# Altium project EDNPV.PrjPcb
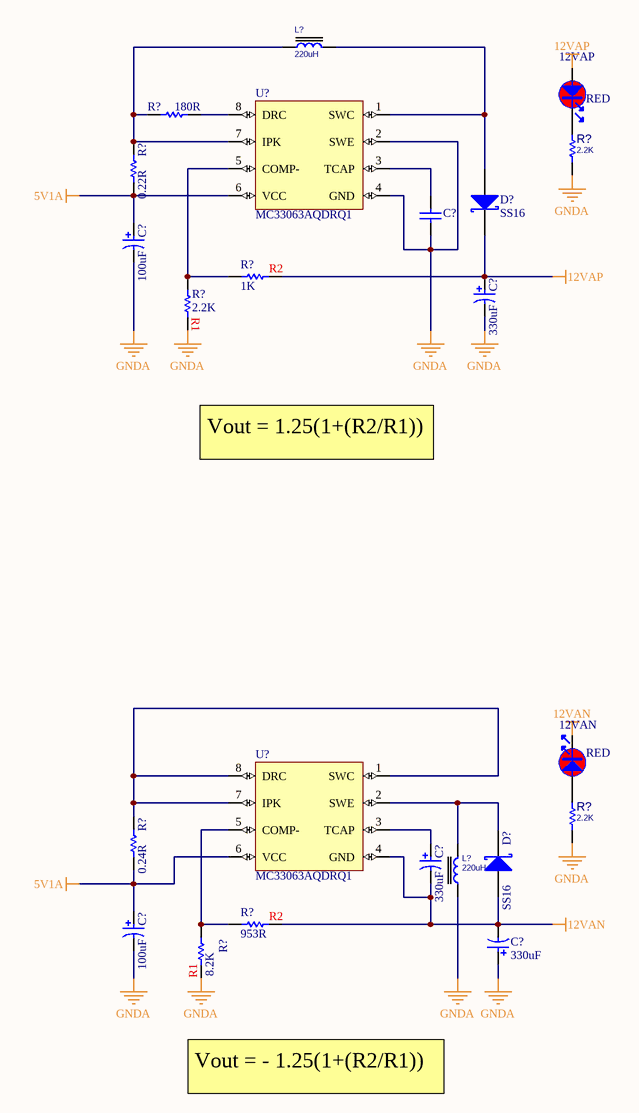
[diagram p0: EDNPV.SchDoc]
1 sheet, 23 parts. Net scope: global (net labels, ports and power ports of the same name join across sheets).
Board file: EDNPV.PcbDoc

## Sheet EDNPV.SchDoc
size A0

### Parts
(Parts that share a designator on the sheet are numbered #1, #2 ... from top to bottom, then left to right.)
?#1  12VAP  value RED  [LED_0603_OSRAM_LS-Q976-NR-1_RED_1A2K_H0P8]
?#2  12VAN  value RED  [LED_0603_OSRAM_LS-Q976-NR-1_RED_1A2K_H0P8]
C?#1  Capacitance: 100uF  [KEMT-T491-A_L]  (hidden comment: T491A476M006AT)
C?#2  CAP0603  [C0603]  (value not drawn)
C?#3  Capacitance: 330uF  [KEMT-T491-A_L]  (hidden comment: T491A476M006AT)
C?#4  Capacitance: 330uF  [KEMT-T491-A_L]  (hidden comment: T491A476M006AT)
C?#5  Capacitance: 100uF  [KEMT-T491-A_L]  (hidden comment: T491A476M006AT)
C?#6  Capacitance: 330uF  [KEMT-T491-A_L]  (hidden comment: T491A476M006AT)
D?#1  SS16  [FAIR-SMA-2_B_V]
D?#2  SS16  [FAIR-SMA-2_B_V]
L?#1  220uH  [L_7]
L?#2  220uH  [L_7]
R?#1  value 180R  [R1206]
R?#2  2.2K  [R0603]
R?#3  value 0.22R  [R1206]
R?#4  1K  [R0603]
R?#5  2.2K  [R0603]
R?#6  2.2K  [R0603]
R?#7  value 0.24R  [R1206]
R?#8  953R  [R0603]
R?#9  8.2K  [R0603]
U?#1  MC33063AQDRQ1  [D0008A_L]
U?#2  MC33063AQDRQ1  [D0008A_L]

### Nets
5V1A: C?#1.1 C?#5.1 R?#3.1 R?#7.1 U?#1.6(VCC) U?#2.6(VCC)
12VAN: ?#2.2 C?#4.2 C?#6.2 D?#2.1(A) R?#8.1 U?#2.4(GND)
12VAP: ?#1.1 C?#3.1 D?#1.2(K) R?#4.1
GNDA: C?#1.2 C?#2.1 C?#3.2 C?#5.2 C?#6.1 L?#2.1 R?#2.1 R?#5.1 R?#6.1 R?#9.1 U?#1.2(SWE) U?#1.4(GND)
Net?#1_2: ?#1.2 R?#2.2
Net?#2_1: ?#2.1 R?#6.2
NetC?#2_2: C?#2.2 U?#1.3(TCAP)
NetC?#4_1: C?#4.1 U?#2.3(TCAP)
NetD?#1_1: D?#1.1(A) L?#1.2 U?#1.1(SWC)
NetD?#2_2: D?#2.2(K) L?#2.2 U?#2.2(SWE)
NetL?#1_1: L?#1.1 R?#1.1 R?#3.2 U?#1.7(IPK)
NetR?#1_2: R?#1.2 U?#1.8(DRC)
NetR?#4_2: R?#4.2 R?#5.2 U?#1.5(COMP-)
NetR?#7_2: R?#7.2 U?#2.1(SWC) U?#2.7(IPK) U?#2.8(DRC)
NetR?#8_2: R?#8.2 R?#9.2 U?#2.5(COMP-)

### Notes on the sheet
- (near R?#4) R2
- (near R?#5) R1
- Vout = 1.25(1+(R2/R1))
- (near R?#8) R2
- (near R?#9) R1
- Vout = - 1.25(1+(R2/R1))

### Library data of the parts
?#1 ?#2 = MCD-00586: LED Red, 0603 SMD, Forward Voltage Typ=2V, Max=2.5V; Part_Type: Display; Manufacturer_Part_Number: LS Q976-NR-1; Manufacturer: OSRAM OPTO SEMICONDUCTORS; Alternate_Manufacturer_Part_Number: VLMS1300-GS08; Alternate_Manufacturer: VISHAY SEMICONDUCTOR OPTO DIVISION; Provided_By: SUBCO; Internal_Part_Number: MCD-00586; Status: Released; Package: LED 0603; ComponentLink1Description: Datasheet; ComponentLink1URL: http://tunmcdsvn.tun.st.com/Component_Datasheet_Library/Trunk/Display/OSRAM_LED_RED_LS Q976-NR-1; Order_Code_Digikey: 475-2512-1-ND; ECCN_US: n/a; ECCN_EU: n/a
C?#1 C?#3-C?#6 = CMP-2000-07189-1: Tantalum Surface Mount Capacitor, 47 uF, +/- 20%, 6.3 V, -55 to 125 degC, 2-Pin SMD, RoHS, Tape and Reel; Manufacturer: Kemet; Wire Form: NotRequired; Case Style: Molded; Product Length (mm): 3.2mm; Product Diameter (mm): NotRequiredmm; ESR: 3.5ohm; Rad Hardened: No; Product Height (mm): 1.6mm; Polarity: Polar; DCL: 3uA; Voltage: 6.3VDC; DF: 12%; Package Description: 2-Pin Surface Mount Device, Body 3.2 x 1.6 mm; Insulation: NotRequired; Datasheet Version: 06/2016; Package / Case: 3216-18; Case Code: A; Packaging: TapeandReel; Mounting Style: SurfaceMount; Length W/Weld: NotRequiredmm; Product Depth (mm): 1.6mm; Datasheet URL: http://www.kemet.com/Lists/ProductCatalog/Attachments/254/KEM_T2005_T491.pdf; Length W/Weld (max): NotRequiredmm; Tolerance (+ or -): 20%; Manufacturer URL: http://www.kemet.com/; Seal: NotRequired; Mounting Technology: SurfaceMount; Construction: SMTChip; Failure Rate: NotRequired; Operating Temp Range: -55Cto125C; Lead Spacing (nom): NotRequiredmm; Seated Plane Height: NotRequiredmm; Package Reference: T491-A
C?#2 = CAP_5: 0603 (1608 Metric) Chip Capacitor; Case-Metric: 1608; Case-EIA: 0603; PackageReference: CAPC0603(1608)100
D?#1 D?#2 = CMP-2000-07149-1: Schottky Rectifier, 700 mV, -65 to 125 degC, 2-Pin SMA, RoHS, Tape and Reel; Manufacturer: FairchildSemiconductor; Type: SchottkyDiode; Peak Average Forward Current: 1@Ta=75CA; Peak Reverse Current: 200uA; Peak Non-Repetitive Surge Current: 40A; Configuration: Single; Peak Forward Voltage: 0.7V; Peak Reverse Repetitive Voltage: 60V; Package: 2DO-214AC; Datasheet URL: http://www.mouser.com/ds/2/149/SS16-196707.pdf; Package Description: 2-Pin Surface Mount Device, Body 4.375 x 2.725 mm; Packaging: Tape&Reel; Package Reference: SMA-2; Mounting: SurfaceMount; Operating Temperature: -65to125°C; Datasheet Version: Rev. 1.9, 01/2015; Mounting Technology: SurfaceMount; Category: Rectifier; Manufacturer URL: https://www.fairchildsemi.com/
L?#1 L?#2 = IND_SMD_470nH_20A: INDUCTOR, 470nH, 20A (Irms), 3.4mOhm; PARAM: 20A (Irms), 26A Isat, -40~130oC; MANF: Pulse; PARAM2: 3.4mOhm, 3.2mm Height; MANF_P#: PG0426.471NLT; PRICE: 3$; ASSEMBLY: ASSEMBLY; VALUE: 220uH
R?#1 R?#3-R?#5 R?#7-R?#9 = RES_3: 0603 (1608 Metric) Chip Resistor; Case-Metric: 1608; Case-EIA: 0603; PackageReference: RESC0603(1608)
R?#2 R?#6 = RES_SMD_0603: RESISTOR, SMD; PARAM: -W; DESC: DESCRIPTION; DIST#: MOUSER; PARAM2: 1%; MANF_P#: -; MANF: -; ASSEMBLY: ASSEMBLY; PRICE: 100= 0.5$; VALUE: 2.2K
U?#1 U?#2 = CMP-0344-00012-2: Inverting Buck-Boost Regulator with 3 to 40 V Input and 1.25 to 40 V Output, -40 to 125 degC, 8-Pin SOIC (D), Green (RoHS & no Sb/Br); Manufacturer: Texas Instruments; Vin(Min)(V): 3; Regulated Outputs(#): 1; Switching Frequency(Max)(kHz): 100; Vout(Max)(V): 40; Switch Current Limit(Typ)(A): 1.5; SubFamily: Inverting Regulator; Vout(Min)(V): 1.25; DatasheetVersion: SLLS654B; PackageVersion: revM, Jun-2011; ComponentLink1Description: Datasheet; Vin(Max)(V): 40; PackageReference: D0008A; ComponentLink2URL: http://www.ti.com/litv/pdf/msoi002j; Mounting Technology: Surface Mount; PartNumber: MC33063AQDRQ1; ComponentLink1URL: http://www.ti.com/general/docs/lit/getliterature.tsp?genericPartNumber=MC33063A-Q1&fileType=pdf; Topology: Inverting Buck-Boost; ComponentLink2Description: Package Specification; PackageDescription: 8-Pin Plastic Small Outline Integrated Circuit, 4.9 x 3.9 mm, Pitch 1.27 mm Pitch; Code_JEDEC: MS-012AA; Eco-Plan: Green (RoHS & no Sb/Br)